# Altium schematic sheet ETHERNET_W5500.SchDoc
size A4; SheetNumber: 21; SheetTotal: 26
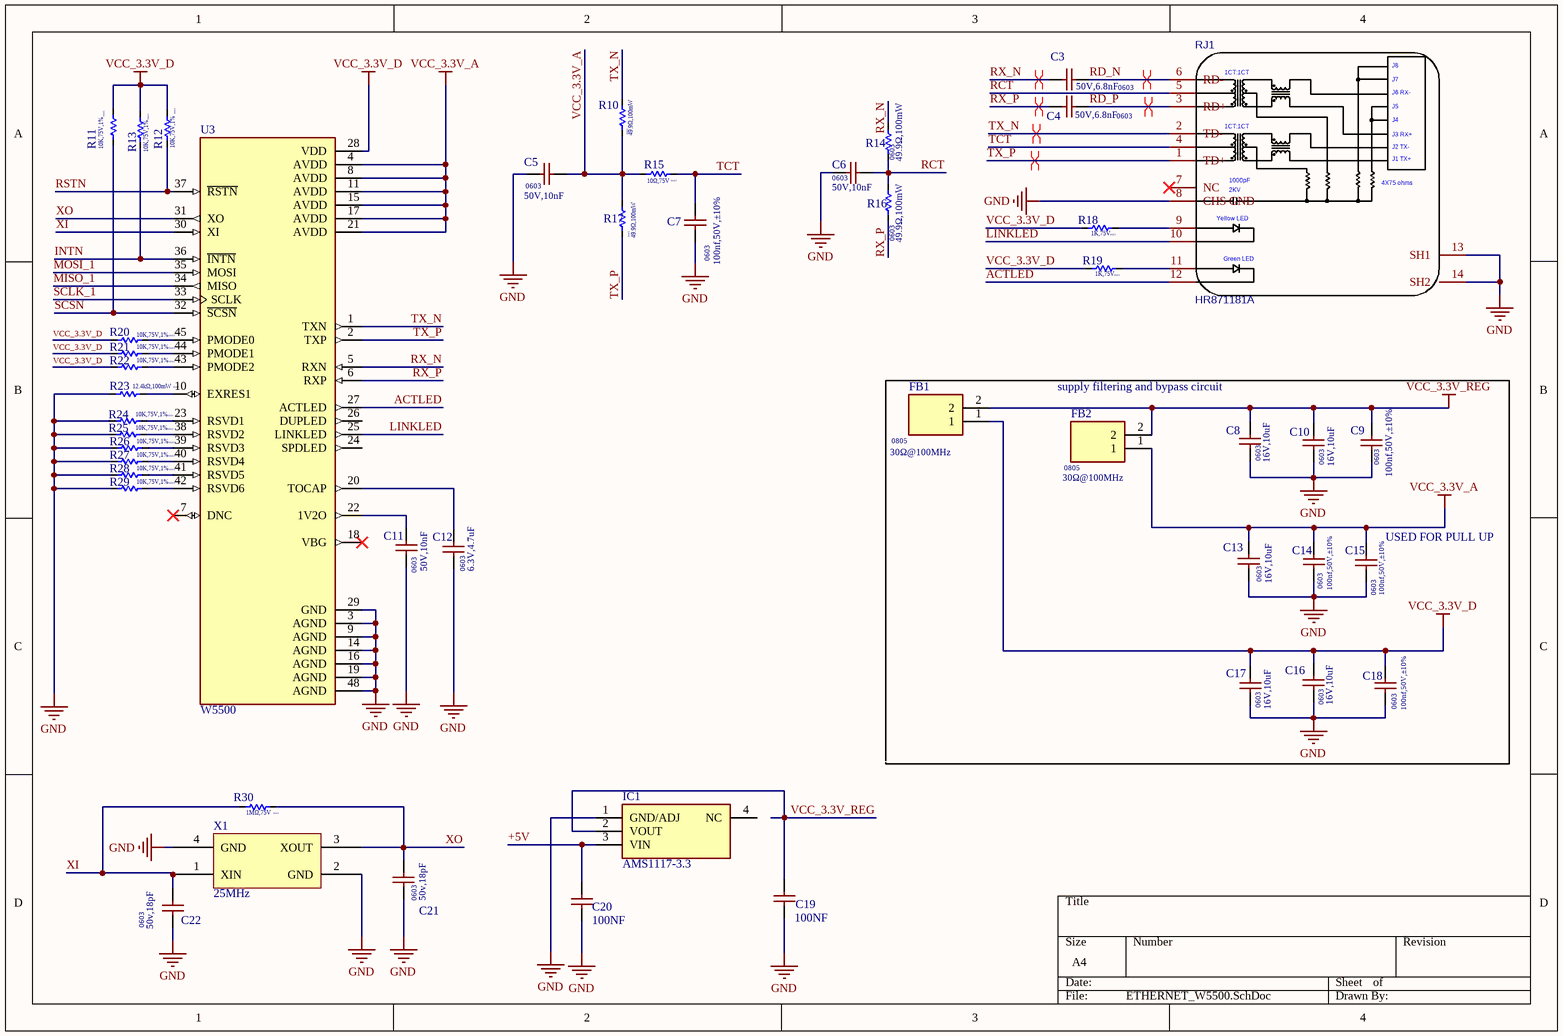
[diagram p0: ETHERNET_W5500.SchDoc]

## Parts
C3  value 50V,6.8nF  Package: 0603  [CAPC1608X90N]  (hidden comment: 6.8nf)
C4  value 50V,6.8nF  Package: 0603  [CAPC1608X90N]  (hidden comment: 6.8nf)
C5  value 50V,10nF  Package: 0603  [CAPC1608X90N]  (hidden comment: 10nf)
C6  value 50V,10nF  Package: 0603  [CAPC1608X90N]  (hidden comment: 10nf)
C7  value 100nf,50V,±10%  Package: 0603  [C0603]  (hidden comment: 100nf/50v)
C8  value 16V,10uF  Package: 0603  [CAPC1608X90N]  (hidden comment: 10uf)
C9  value 100nf,50V,±10%  Package: 0603  [C0603]  (hidden comment: 100nf/50v)
C10  value 16V,10uF  Package: 0603  [CAPC1608X90N]  (hidden comment: 10uf)
C11  value 50V,10nF  Package: 0603  [CAPC1608X90N]  (hidden comment: 10nf)
C12  value 6.3V,4.7uF  Package: 0603  [CAPC1608X90N]  (hidden comment: 4.7uf)
C13  value 16V,10uF  Package: 0603  [CAPC1608X90N]  (hidden comment: 10uf)
C14  value 100nf,50V,±10%  Package: 0603  [C0603]  (hidden comment: 100nf/50v)
C15  value 100nf,50V,±10%  Package: 0603  [C0603]  (hidden comment: 100nf/50v)
C16  value 16V,10uF  Package: 0603  [CAPC1608X90N]  (hidden comment: 10uf)
C17  value 16V,10uF  Package: 0603  [CAPC1608X90N]  (hidden comment: 10uf)
C18  value 100nf,50V,±10%  Package: 0603  [C0603]  (hidden comment: 100nf/50v)
C19  100NF  [C0603]
C20  100NF  [C0603]
C21  value 50v,18pF  Package: 0603  [CAPC1608X90N]  (hidden comment: 18pF)
C22  value 50v,18pF  Package: 0603  [CAPC1608X90N]  (hidden comment: 18pF)
FB1  value 30Ω@100MHz  Package: 0805  [BEADC2012X105N]  (hidden comment: BLM21PG300SN1D)
FB2  value 30Ω@100MHz  Package: 0805  [BEADC2012X105N]  (hidden comment: BLM21PG300SN1D)
IC1  AMS1117-3.3  [SOT229P700X180-4N]
R10  value 49.9Ω,100mW  Package: 0603  [R0603]  (hidden comment: 49.9 R)
R11  Package: 0603  [R0603]  (hidden comment: 10K,75V,1%)
R12  Package: 0603  [R0603]  (hidden comment: 10K,75V,1%)
R13  Package: 0603  [R0603]  (hidden comment: 10K,75V,1%)
R14  value 49.9Ω,100mW  Package: 0603  [R0603]  (hidden comment: 49.9 R)
R15  value 10Ω,75V  Package: 0603  [R0603]  (hidden comment: 10R)
R16  value 49.9Ω,100mW  Package: 0603  [R0603]  (hidden comment: 49.9 R)
R17  value 49.9Ω,100mW  Package: 0603  [R0603]  (hidden comment: 49.9 R)
R18  value 1K,75V  Package: 0603  [R0603]  (hidden comment: 1K)
R19  value 1K,75V  Package: 0603  [R0603]  (hidden comment: 1K)
R20  Package: 0603  [R0603]  (hidden comment: 10K,75V,1%)
R21  Package: 0603  [R0603]  (hidden comment: 10K,75V,1%)
R22  Package: 0603  [R0603]  (hidden comment: 10K,75V,1%)
R23  value 12.4kΩ,100mW  Package: 0603  [R0603]  (hidden comment: 12.4kΩ)
R24  Package: 0603  [R0603]  (hidden comment: 10K,75V,1%)
R25  Package: 0603  [R0603]  (hidden comment: 10K,75V,1%)
R26  Package: 0603  [R0603]  (hidden comment: 10K,75V,1%)
R27  Package: 0603  [R0603]  (hidden comment: 10K,75V,1%)
R28  Package: 0603  [R0603]  (hidden comment: 10K,75V,1%)
R29  Package: 0603  [R0603]  (hidden comment: 10K,75V,1%)
R30  value 1MΩ,75V  Package: 0603  [R0603]  (hidden comment: 1M)
RJ1  HR871181A  [HR871181A_mirror]
U3  W5500  [W5500 Ethernet]
X1  25MHz  [SMD Crystal]

## Nets
GND: C5.1 C6.1 C7.1 C8.1 C9.1 C10.1 C11.2 C12.2 C13.1 C14.1 C15.1 C16.1 C17.1 C18.1 C19.2 C20.2 C21.2 C22.2 IC1.1(GND/ADJ) R23.1 R24.2 R25.2 R26.2 R27.2 R28.2 R29.2 RJ1.8(CHS_GND) RJ1.13(SH1) RJ1.14(SH2) U3.3(AGND) U3.9(AGND) U3.14(AGND) U3.16(AGND) U3.19(AGND) U3.29(GND) U3.48(AGND) X1.2(GND) X1.4(GND)
VCC_3.3V_A: C5.2 C13.2 C14.2 C15.2 FB2.1 R10.1 R15.1 R17.2 U3.4(AVDD) U3.8(AVDD) U3.11(AVDD) U3.15(AVDD) U3.17(AVDD) U3.21(AVDD)
VCC_3.3V_D: C16.2 C17.2 C18.2 FB1.1 R11.2 R12.2 R13.2 R18.1 R19.1 R20.2 R21.2 R22.2 U3.28(VDD)
VCC_3.3V_REG: C8.2 C9.2 C10.2 C19.1 FB1.2 FB2.2 IC1.2(VOUT)
+5V: C20.1 IC1.3(VIN)
ACTLED: RJ1.12 U3.27(ACTLED)
INTN: R13.1 U3.36(~{INTN})
LINKLED: RJ1.10 U3.25(LINKLED)
MISO_1: U3.34(MISO)
MOSI_1: U3.35(MOSI)
RCT: C6.2 R14.1 R16.2 RJ1.5
RD_N: C3.2 RJ1.6(RD-)
RD_P: C4.2 RJ1.3(RD+)
RSTN: R12.1 U3.37(~{RSTN})
RX_N: C3.1 R14.2 U3.5(RXN)
RX_P: C4.1 R16.1 U3.6(RXP)
SCLK_1: U3.33(SCLK)
SCSN: R11.1 U3.32(~{SCSN})
TCT: C7.2 R15.2 RJ1.4
TX_N: R10.2 RJ1.2(TD-) U3.1(TXN)
TX_P: R17.1 RJ1.1(TD+) U3.2(TXP)
XI: C22.1 R30.1 U3.30(XI) X1.1(XIN)
XO: C21.1 R30.2 U3.31(XO) X1.3(XOUT)
NetC11_1: C11.1 U3.22(1V2O)
NetC12_1: C12.1 U3.20(TOCAP)
NetR18_2: R18.2 RJ1.9
NetR19_2: R19.2 RJ1.11
NetR20_1: R20.1 U3.45(PMODE0)
NetR21_1: R21.1 U3.44(PMODE1)
NetR22_1: R22.1 U3.43(PMODE2)
NetR23_2: R23.2 U3.10(EXRES1)
NetR24_1: R24.1 U3.23(RSVD1)
NetR25_1: R25.1 U3.38(RSVD2)
NetR26_1: R26.1 U3.39(RSVD3)
NetR27_1: R27.1 U3.40(RSVD4)
NetR28_1: R28.1 U3.41(RSVD5)
NetR29_1: R29.1 U3.42(RSVD6)

Not connected (* = marked no-connect by the designer): IC1 4(NC); RJ1 7(NC)*; U3 7(DNC)* 18(VBG)* 24(SPDLED) 26(DUPLED)

## Layout directives
differential pair; differential pair class RX1: RD_N, RD_P
differential pair; differential pair class RX: RX_N, RX_P
differential pair; differential pair class TX: TX_N, TX_P

## Notes on the sheet
- supply filtering and bypass circuit
- (near C15) USED FOR PULL UP
- (in symbol HR871181A_mirror) J8; 1CT:1CT; J7; J6 RX-; J5; J4; J3 RX+; J2 TX-; J1 TX+; 1000pF; 4X75 ohms; 2KV; Yellow LED; Green LED

## Library data of the parts
C3 C4 = 0603B682K500CT: 50V 6.8nF X7R ±10% 0603 Multilayer Ceramic Capacitors MLCC - SMD/SMT ROHS; Manufacturer: Walsin Tech Corp; Datasheet: https://datasheet.lcsc.com/lcsc/2304140030_Walsin-Tech-Corp-0603B682K500CT_C123518.pdf; LCSC: C123518; MPN: 0603B682K500CT
C5 C6 C11 = TCC0603X7R103M500CT: 50V 10nF X7R ±20% 0603 Multilayer Ceramic Capacitors MLCC - SMD/SMT ROHS; Manufacturer: CCTC; Datasheet: https://datasheet.lcsc.com/lcsc/2304140030_CCTC-TCC0603X7R103M500CT_C376807.pdf; LCSC: C376807; MPN: TCC0603X7R103M500CT
C7 C9 C14 C15 C18 = CC0603KRX7R9BB104: 50V 100nF X7R ±10% 0603 Multilayer Ceramic Capacitors MLCC - SMD/SMT ROHS; MPN: 603-CC603KRX7R9BB104; Manufacturer: KEMET; Max Operating Temp: 35 °C; Min Operating Temp: 15 °C; Datasheet: http://componentsearchengine.com/Datasheets/3/CC0603KRX7R9BB104.pdf; LCSC: C14663
C8 C10 C13 C16 C17 = 0603F106M160NT: 16V 10uF Y5V ±20% 0603 Multilayer Ceramic Capacitors MLCC - SMD/SMT ROHS; Manufacturer: KEMET; MPN: CC0603KRX7R9BB104; Datasheet: http://componentsearchengine.com/Datasheets/3/CC0603KRX7R9BB104.pdf; LCSC: C48906
C12 = CL10A475KQ8NNNC: Capacitor; Manufacturer: Samsung Electro-Mechanics; Datasheet: https://lcsc.componentsearchengine.com/Datasheets/2/CL10A475KQ8NNNC.pdf; MPN: CL10A475KQ8NNNC; LCSC: C8032
C19 C20 = CC0603KRX7R9BB104: 50V 100nF X7R ±10% 0603 Multilayer Ceramic Capacitors MLCC - SMD/SMT ROHS; MPN: 603-CC603KRX7R9BB104; Manufacturer: KEMET; Value: 100nf,50V,±10%; Package: 0603; Max Operating Temp: 35 °C; Min Operating Temp: 15 °C; Datasheet: http://componentsearchengine.com/Datasheets/3/CC0603KRX7R9BB104.pdf; LCSC: C14663
C21 C22 = CC0603JRNPO9BN180: 50V 18pF NP0 ±5% 0603 Multilayer Ceramic Capacitors MLCC - SMD/SMT ROHS; Manufacturer: YAGEO; LCSC: C107040; Datasheet: https://www.lcsc.com/datasheet/lcsc_datasheet_2304140030_YAGEO-CC0603JRNPO9BN180_C107040.pdf; MPN: CC0603JRNPO9BN180
FB1 FB2 = BLM21PG300SN1D: Ferrite Bead; Manufacturer: Murata Electronics; Datasheet: https://www.murata.com/en-global/products/productdetail?partno=BLM21PG300SN1%23; MPN: BLM21PG300SN1D; LCSC: C16903
IC1 = AMS1117-3.3: Integrated Circuit; Manufacturer: Advanced; Datasheet: https://datasheet.datasheetarchive.com/originals/distributors/Datasheets-28/DSA-550594.pdf; MPN: AMS1117-3.3
R10 R14 R16 R17 = ERJ-3EKF49R9V: 100mW Thick Film Resistors ±100ppm/℃ ±1% 49.9Ω 0603 Chip Resistor - Surface Mount ROHS; Manufacturer: Panasonic; Datasheet: https://industrial.panasonic.com/cdbs/www-data/pdf/RDA0000/AOA0000C304.pdf; MPN: ERJ-3EKF49R9V; LCSC: C403255
R11-R13 R20-R22 R24-R29 = 0603WAF1002T5E: 100mW Thick Film Resistors ±100ppm/℃ ±1% 10kΩ 0603 Chip Resistor - Surface Mount ROHS; Manufacturer: UNI-ROYAL(Uniroyal Elec); Max Operating Temp: 155℃; Min Operating Temp: -55℃; MPN: 0603WAF1002T5E; Datasheet: https://datasheet.lcsc.com/szlcsc/Uniroyal-Elec-0603WAF1002T5E_C25804.pdf; LCSC: C25804; Value: 10K,75V,1%
R15 = QR0603J10R0P05Z: 100mW Thick Film Resistors 75V ±5% ±100ppm/℃ -55℃~+155℃ 10Ω 0603 Chip Resistor - Surface Mount ROHS; Manufacturer: Ever Ohms Tech; Datasheet: https://datasheet.lcsc.com/lcsc/2304140030_Ever-Ohms-Tech-QR0603J10R0P05Z_C176153.pdf; LCSC: C176153; MPN: QR0603J10R0P05Z
R18 R19 = 0603WAF1001T5E: 100mW Thick Film Resistors 75V ±100ppm/℃ ±1% 1kΩ 0603 Chip Resistor - Surface Mount ROHS; Manufacturer: UNI-ROYAL(Uniroyal Elec); Datasheet: https://datasheet.lcsc.com/szlcsc/Uniroyal-Elec-0603WAF1001T5E_C21190.pdf; MPN: 0603WAF1001T5E; LCSC: C21190
R23 = ERJ-3EKF1242V: Resistor; Manufacturer: Panasonic; Datasheet: https://industrial.panasonic.com/cdbs/www-data/pdf/RDA0000/AOA0000C304.pdf; MPN: ERJ-3EKF1242V; LCSC: C194071
R30 = 0603WAF1004T5E: 100mW Thick Film Resistors ±100ppm/℃ ±1% 1MΩ 0603 Chip Resistor - Surface Mount ROHS; Manufacturer: UNI-ROYAL(Uniroyal Elec); MPN: 0603WAF1002T5E; Datasheet: https://datasheet.lcsc.com/szlcsc/Uniroyal-Elec-0603WAF1002T5E_C25804.pdf; LCSC: C22935
RJ1 = HR871181A_mirror: BOM_Manufacturer: HANRUN(汉仁); BOM_Supplier: LCSC; BOM_Manufacturer Part: HR871181A; BOM_Supplier Part: C49312; BOM_JLCPCB Part Class: Extended Part; spicePre: R; spiceSymbolName: HR871181A
U3 = W5500: Ethernet Controller 10/100 Base-T/TX PHY SPI Interface 48-LQFP (7x7); MF: WIZnet; Value: *; Package: None; Check_prices: https://www.snapeda.com/parts/W5500/WIZnet/view-part/?ref=eda; Price: None; MP: W5500; Availability: In Stock; SnapEDA_Link: https://www.snapeda.com/parts/W5500/WIZnet/view-part/?ref=snap; Purchase-URL: https://pricing.snapeda.com/search/part/W5500/?ref=eda
X1 = 3TJ425000XYFBC: 25MHz SMD Crystal Resonator 18pF 60Ω ±10ppm ±30ppm -40℃~+85℃ SMD3225-4P Crystals ROHS